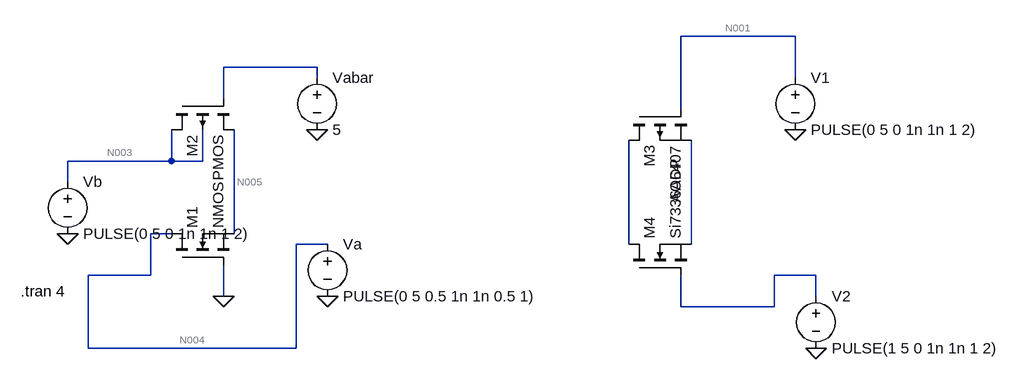
[diagram p0: schematic transmission_AND.asc]
transmission_AND.asc, the LTspice schematic file:
Version 4
SHEET 1 1464 680
WIRE 1136 -64 960 -64
WIRE 400 -16 256 -16
WIRE 400 0 400 -16
WIRE 1136 0 1136 -64
WIRE 256 32 256 -16
WIRE 960 48 960 -64
WIRE 176 128 176 80
WIRE 176 128 16 128
WIRE 224 128 224 80
WIRE 224 128 176 128
WIRE 16 160 16 128
WIRE 176 240 144 240
WIRE 272 240 272 80
WIRE 416 256 368 256
WIRE 880 256 880 96
WIRE 976 256 976 96
WIRE 144 304 144 240
WIRE 144 304 48 304
WIRE 1168 304 1104 304
WIRE 256 336 256 288
WIRE 1168 336 1168 304
WIRE 960 352 960 304
WIRE 1104 352 1104 304
WIRE 1104 352 960 352
WIRE 48 416 48 304
WIRE 368 416 368 256
WIRE 368 416 48 416
FLAG 16 240 0
FLAG 400 80 0
FLAG 416 336 0
FLAG 1136 80 0
FLAG 1168 416 0
FLAG 256 336 0
SYMBOL voltage 16 144 R0
SYMATTR InstName Vb
SYMATTR Value PULSE(0 5 0 1n 1n 1 2)
SYMBOL voltage 400 -16 R0
WINDOW 123 0 0 Left 0
WINDOW 39 0 0 Left 0
SYMATTR InstName Vabar
SYMATTR Value 5
SYMBOL voltage 416 240 R0
WINDOW 123 0 0 Left 0
WINDOW 39 0 0 Left 0
SYMATTR InstName Va
SYMATTR Value PULSE(0 5 0.5 1n 1n 0.5 1)
SYMBOL pmos 880 48 M90
SYMATTR InstName M3
SYMATTR Value AO6407
SYMBOL nmos 880 304 R270
SYMATTR InstName M4
SYMATTR Value Si7336ADP
SYMBOL voltage 1136 -16 R0
SYMATTR InstName V1
SYMATTR Value PULSE(0 5 0 1n 1n 1 2)
SYMBOL voltage 1168 320 R0
SYMATTR InstName V2
SYMATTR Value PULSE(1 5 0 1n 1n 1 2)
SYMBOL nmos 176 288 R270
SYMATTR InstName M1
SYMBOL pmos4 176 32 M90
SYMATTR InstName M2
TEXT -56 328 Left 2 !.tran 4

The netlist it stands for:
* transmission_AND.asc
Vb N003 0 PULSE(0 5 0 1n 1n 1 2)
Vabar N002 0 5
Va N004 0 PULSE(0 5 0.5 1n 1n 0.5 1)
M3 N006 N001 N007 N007 AO6407
M4 N006 N008 N007 N007 Si7336ADP
V1 N001 0 PULSE(0 5 0 1n 1n 1 2)
V2 N008 0 PULSE(1 5 0 1n 1n 1 2)
M1 N004 0 N005 N005 NMOS
M2 N003 N002 N005 N003 PMOS
.model NMOS NMOS
.model PMOS PMOS
.lib standard.mos
.tran 4
.backanno
.end

* Results of the author's LTspice run, read from the files saved beside the schematic
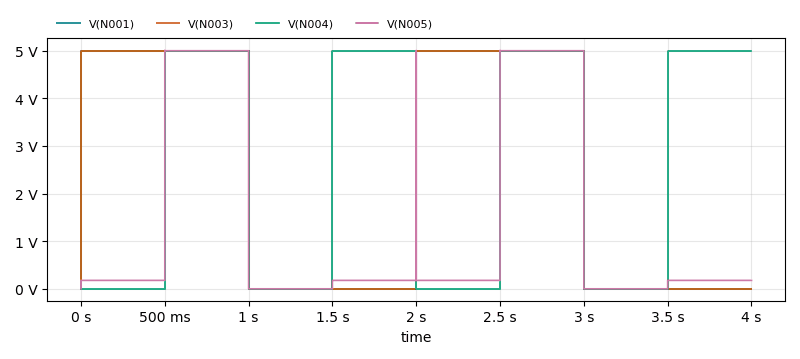
[diagram p1: Transient Analysis of transmission_AND.asc, plotted from the saved traces]
* Transient Analysis, 1 run:
*   V(N001): min 0 V, max 5 V, average 2.5 V, rms 3.536 V, last 0 V
*   V(N003): min 0 V, max 5 V, average 2.5 V, rms 3.536 V, last 0 V
*   V(N004): min 0 V, max 5 V, average 2.5 V, rms 3.536 V, last 5 V
*   V(N005): min 0 V, max 5.008 V, average 1.338 V, rms 2.503 V, last 176.8 mV